# EasyEDA Pro project 立创eda专业版工程文件.epro

# Board PCB1_1
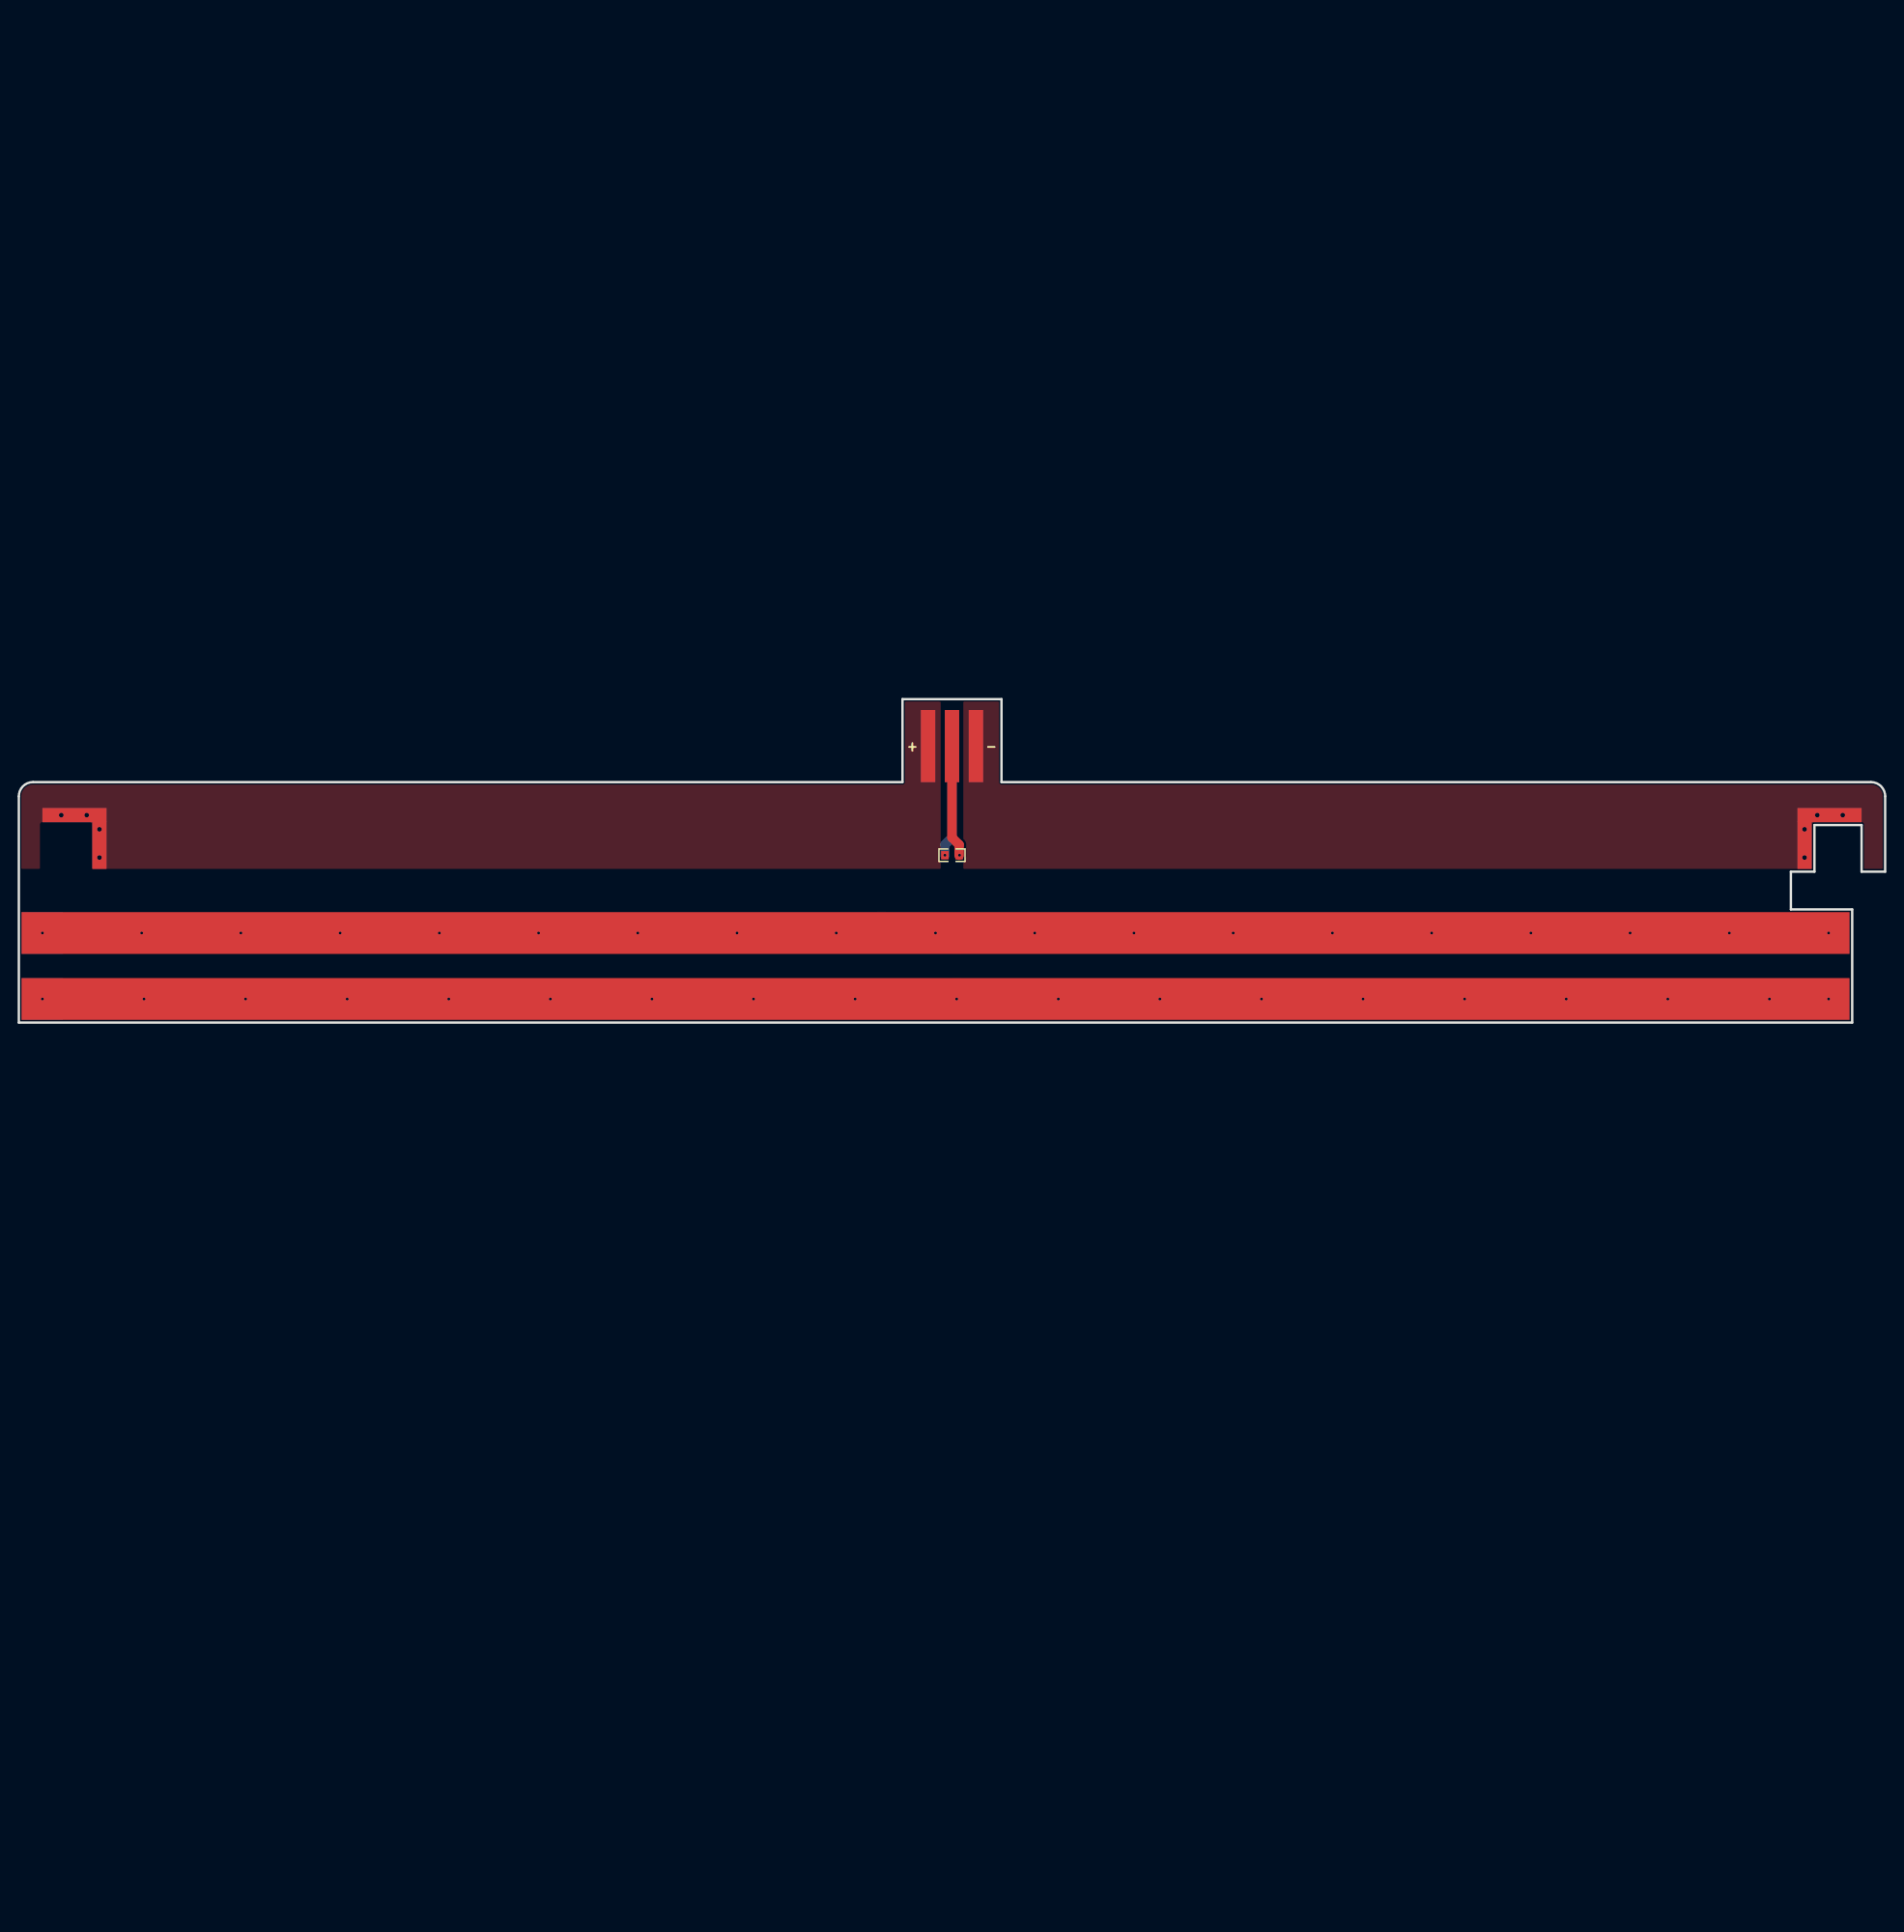
[diagram p0: board, top side]
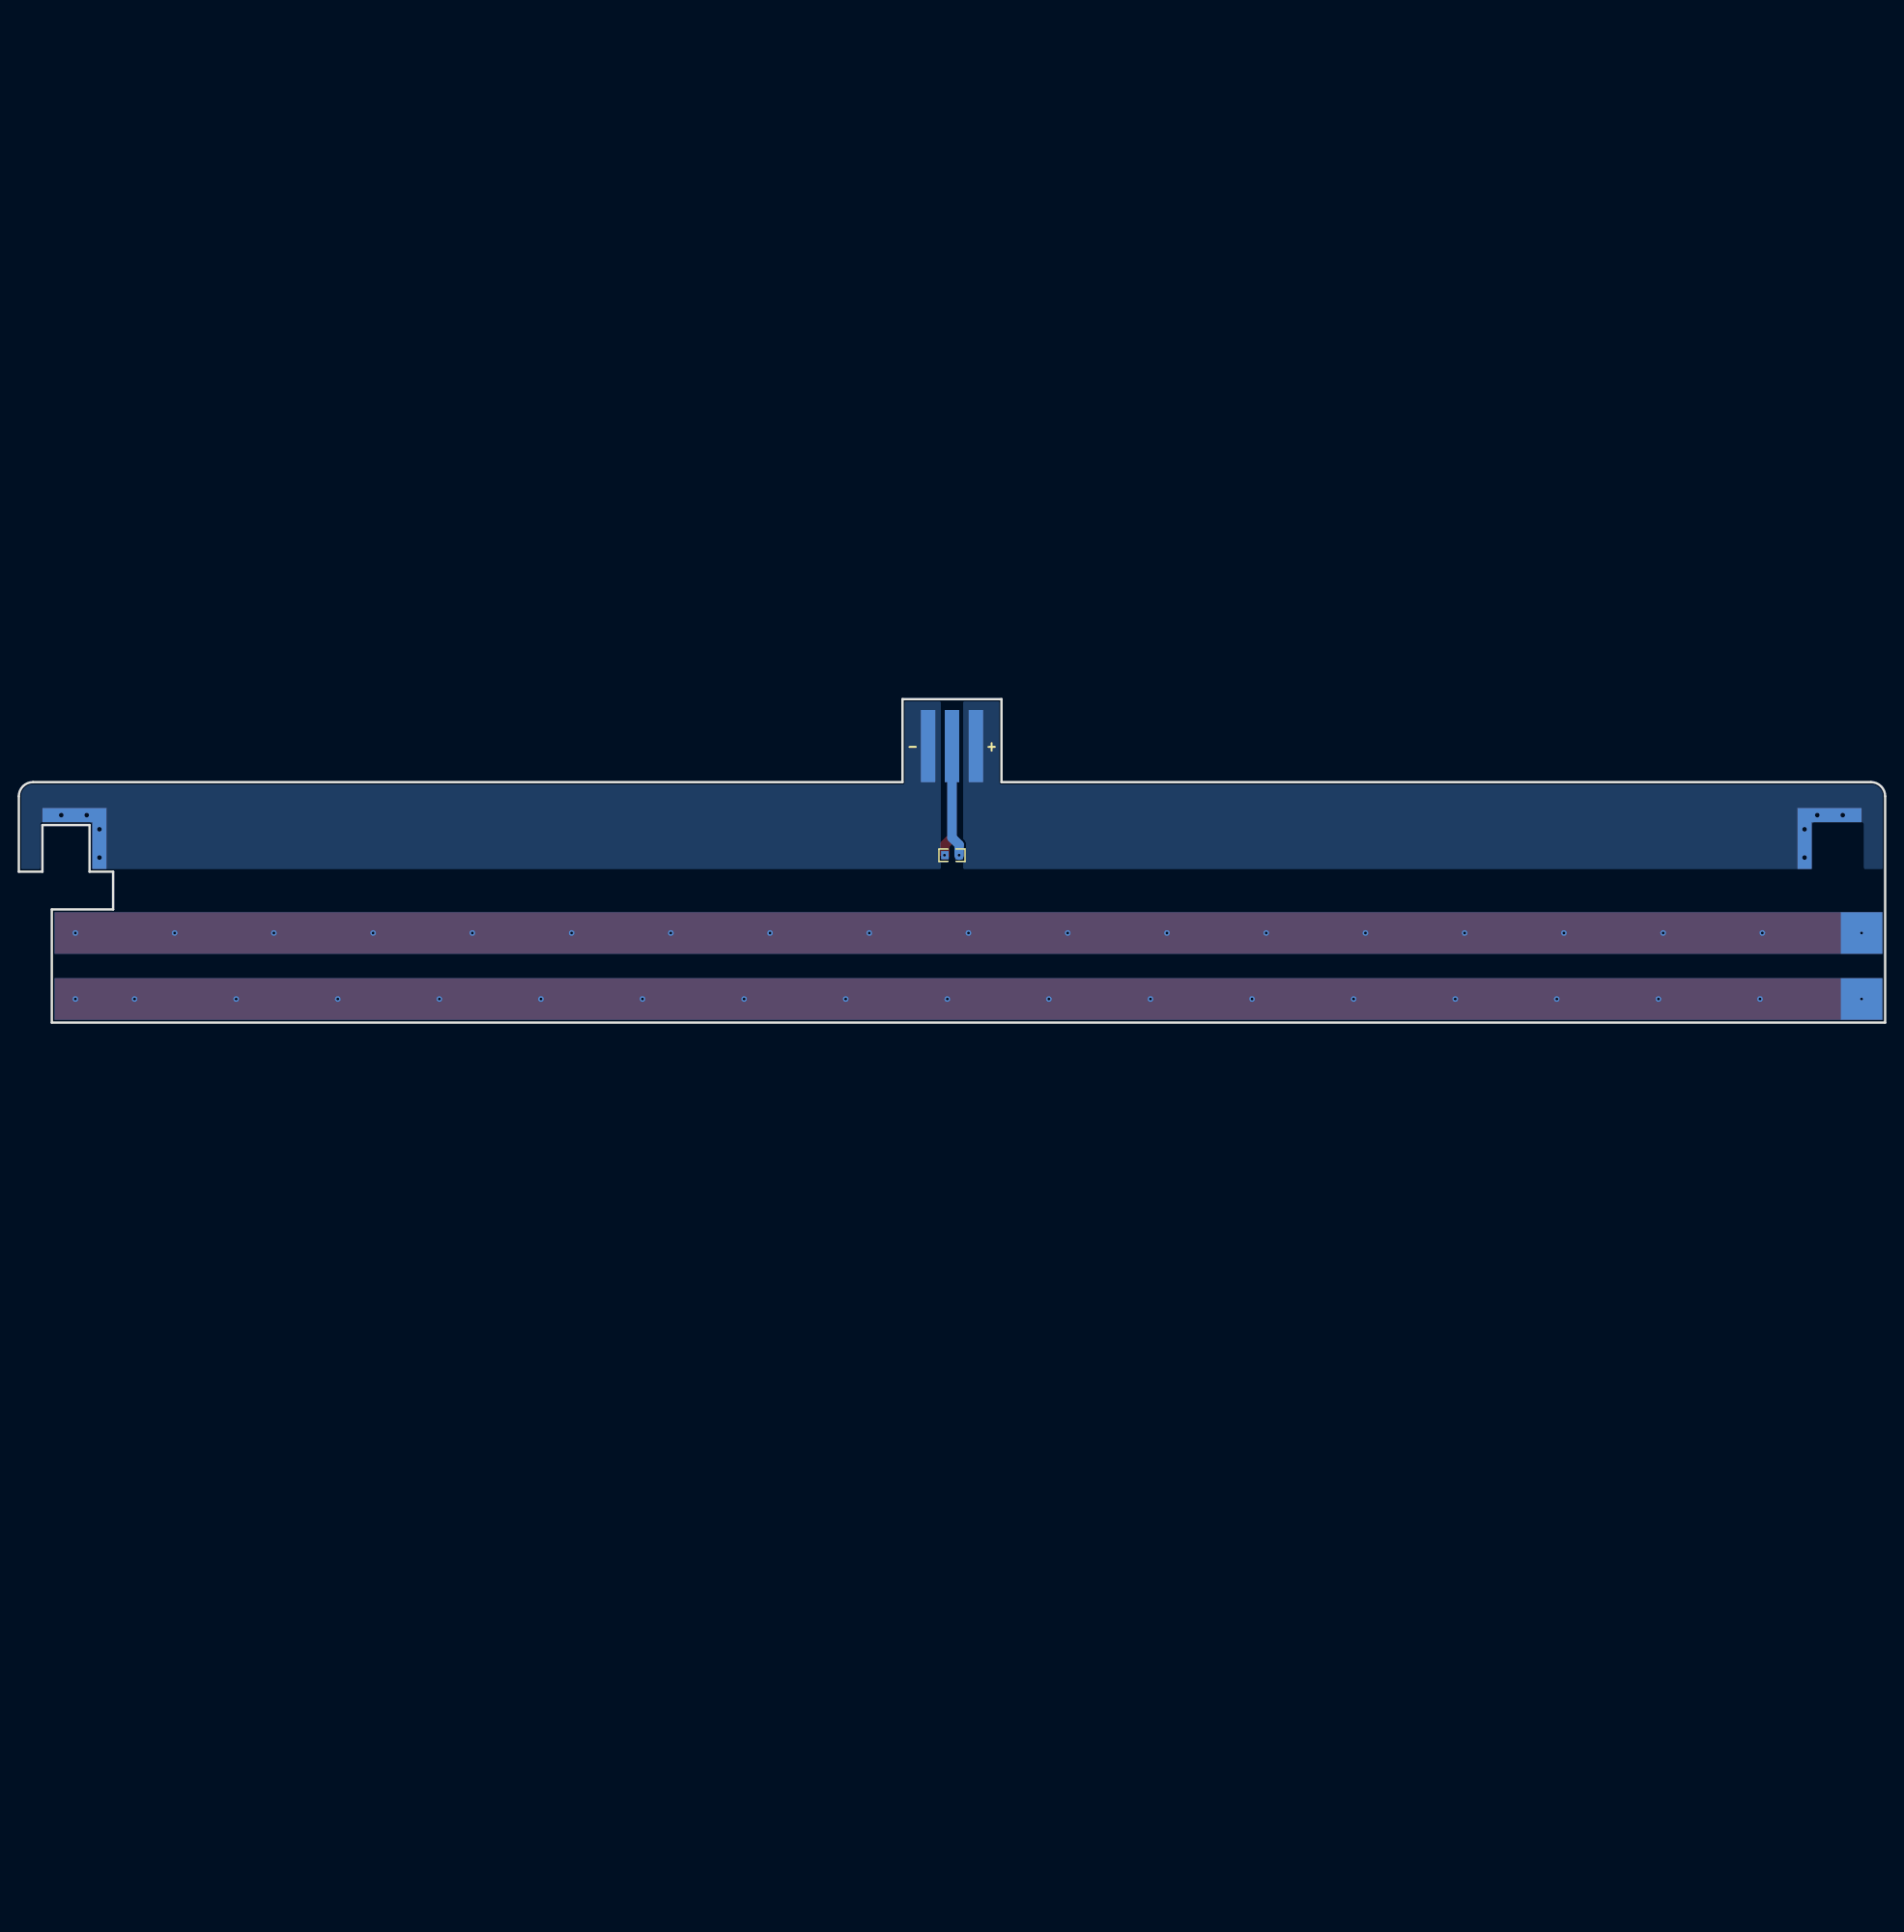
[diagram p1: board, bottom side, seen from below]

Outline 198 x 34.3 mm; copper layers: Top Layer, Bottom Layer. Coordinates in mm from the lower left corner of the outline.
Outline path: 0,24 arc(0.44,25.06) 1.5,25.5 93.75,25.5 93.75,34.3 104.25,34.3 104.25,25.5 196.5,25.5 arc(197.56,25.06) 198,24 198,16 195.5,16 195.5,20.95 190.5,20.95 190.5,16 188,16 188,12 194.5,12 194.5,0 0,0 0,24
Stack: Top Layer 0.035mm / Dielectric1 1.51mm FR4 er 4.5 / Bottom Layer 0.035mm

## Design rules (mm)
template: 自定义配置
spacing copperThickness1oz (default): track to track 0.102, other pairs 0.152 to 0.3
spacing copperThickness2oz: track to track 0.203, other pairs 0.152 to 0.3
track width copperThickness1oz (default): min 0.127, default 0.254, max 2.54
track width copperThickness2oz: min 0.203, default 0.254, max 2.54
differential pair differentialPair (default): width min 0.127, default 0.254, max 2.54; gap min 0.152, default 0.152
via viaSize (default): diameter min 0.5, default 0.61, max 10; hole min 0.3, default 0.305, max 6.3
pour e16 uses copperRegion

## Placement (name value [footprint] x y rotation side)
NOREF  -  [Pad_e240]  2.5 2.5 0 top
NOREF#2  -  [Pad_e184]  97.25 9.5 0 top
NOREF#3  -  [Pad_e510]  101.54 29.33 0 top
NOREF#4  -  [Pad_e274]  192.1 22 0 top
NOREF#5  -  [Pad_e273]  5.9 22 0 top
NOREF#6  -  [Pad_e498]  101.54 29.33 0 top
NOREF#7  -  [R0603]  99 17.75 0 top
NOREF#8  -  [Pad_e238]  2.5 9.5 0 top
NOREF#9  -  [Pad_e190]  5.9 22 0 top
NOREF#10  -  [Pad_e232]  192.1 22 180 top
NOREF#11  -  [Pad_e497]  99 29.33 0 top
NOREF#12  -  [Pad_e343]  97.25 2.5 0 top
NOREF#13  -  [Pad_e230]  189.45 18.8 180 top
NOREF#14  -  [Pad_e192]  8.55 18.8 0 top
NOREF#15  -  [Pad_e509]  99 29.33 0 top
NOREF#16  -  [Pad_e508]  96.46 29.33 0 top
NOREF#17  -  [Pad_e496]  96.46 29.33 0 top
NOREF#18  -  [R0603]  99 17.75 180 bottom

## Footprints (pads in the part's own frame, mm; a bottom-side part is the same pattern mirrored in y, then rotated)
Pad_e184
  rect 193.9x4.4 smd: 1(0,0)
Pad_e190
  rect 6.8x1.5 smd: 1(0,0)
Pad_e192
  rect 1.5x5 smd: 1(0,0)
Pad_e230
  rect 1.5x5 smd: 1(0,0)
Pad_e232
  rect 6.8x1.5 smd: 1(0,0)
Pad_e238
  rect 4.4x4.4 smd far side: 1(0,0)
Pad_e240
  rect 4.4x4.4 smd far side: 1(0,0)
Pad_e273
  custom 0x0 smd far side: 1(0,0)
Pad_e274
  custom 6.8x6.45 smd far side: 1(0,0)
Pad_e343
  rect 193.9x4.4 smd: 1(0,0)
Pad_e496
  rect 1.524x7.65 smd: 1(0,0)
Pad_e497
  rect 1.524x7.65 smd: 1(0,0)
Pad_e498
  rect 1.524x7.65 smd: 2(0,0)
Pad_e508
  rect 1.524x7.65 smd far side: 1(0,0)
Pad_e509
  rect 1.524x7.65 smd far side: 1(0,0)
Pad_e510
  rect 1.524x7.65 smd far side: 2(0,0)
R0603
  rect 0.806x0.864 smd: 1(-0.753,0) 2(0.753,0)

## Nets
1: NOREF#2.1 NOREF#8.1
2: NOREF#5.1 NOREF#9.1 NOREF#14.1 NOREF#16.1 NOREF#17.1
3: NOREF#3.2 NOREF#4.1 NOREF#6.2 NOREF#10.1 NOREF#13.1
11: NOREF.1 NOREF#12.1
R1: NOREF#7.1 NOREF#15.1 NOREF#18.2
R2: NOREF#7.2 NOREF#11.1 NOREF#18.1

## Via types
v1: diameter 0.61, hole 0.305, Top Layer to Bottom Layer, 40 vias
v2: diameter 1, hole 0.5, Top Layer to Bottom Layer, 8 vias

## Routing (per net, layer and track width the routed paths; a pad name or vN(x,y) marks a point on that pad's centre or on a via; arc(x,y) is an arc through that point)
1:
  vias: v1(2.5,9.5) v1(13.03,9.5) v1(23.56,9.5) v1(34.08,9.5) v1(44.61,9.5) v1(55.14,9.5) v1(65.67,9.5) v1(76.19,9.5) v1(86.72,9.5) v1(97.25,9.5) v1(107.78,9.5) v1(118.31,9.5) v1(128.83,9.5) v1(139.36,9.5) v1(149.89,9.5) v1(160.42,9.5) v1(170.94,9.5) v1(181.47,9.5) v1(192,9.5)
2:
  vias: v2(4.5,22) v2(7.2,22) v2(8.55,20.5) v2(8.55,17.5)
3:
  vias: v2(189.45,20.5) v2(189.45,17.5) v2(190.8,22) v2(193.5,22)
11:
  vias: v1(2.5,2.5) v1(13.28,2.5) v1(24.06,2.5) v1(34.83,2.5) v1(45.61,2.5) v1(56.39,2.5) v1(67.17,2.5) v1(77.94,2.5) v1(88.72,2.5) v1(99.5,2.5) v1(110.28,2.5) v1(121.06,2.5) v1(131.83,2.5) v1(142.61,2.5) v1(153.39,2.5) v1(164.17,2.5) v1(174.94,2.5) v1(185.72,2.5) v1(192,2.5)
R1: length 11.9
  Bottom Layer w1: NOREF#15.1 99,19.61 98.25,18.86 v1(98.25,17.75)
R2: length 11.9
  Top Layer w1: NOREF#11.1 99,19.61 99.75,18.86 NOREF#7.2
  vias: v1(99.8,17.75)

## Copper pours and planes (outline as drawn; the poured copper is in the pictures)
1 on Top Layer: 0.25,11.75 194.25,11.75 194.25,7.25 0.25,7.25
1 on Bottom Layer: 0.25,11.75 194.25,11.75 194.25,7.25 0.25,7.25
2 on Top Layer: 0,34.3 97.8,34.3 97.8,16.3 0,16.3
2 on Bottom Layer: 0,34.3 97.8,34.3 97.8,16.3 0,16.3
2 on Bottom Layer: 0,34.3 97.8,34.3 97.8,16.3 0,16.3
3 on Top Layer: 100.2,34.3 198,34.3 198,16.3 100.2,16.3
3 on Bottom Layer: 100.2,34.3 198,34.3 198,16.3 100.2,16.3
3 on Bottom Layer: 100.2,34.3 198,34.3 198,16.3 100.2,16.3
11 on Top Layer: 0.25,4.75 194.25,4.75 194.25,0.25 0.25,0.25
11 on Bottom Layer: 0.25,4.75 194.25,4.75 194.25,0.25 0.25,0.25

## Text on the board
Bottom Silkscreen Layer: + | -
Top Silkscreen Layer: + | -
